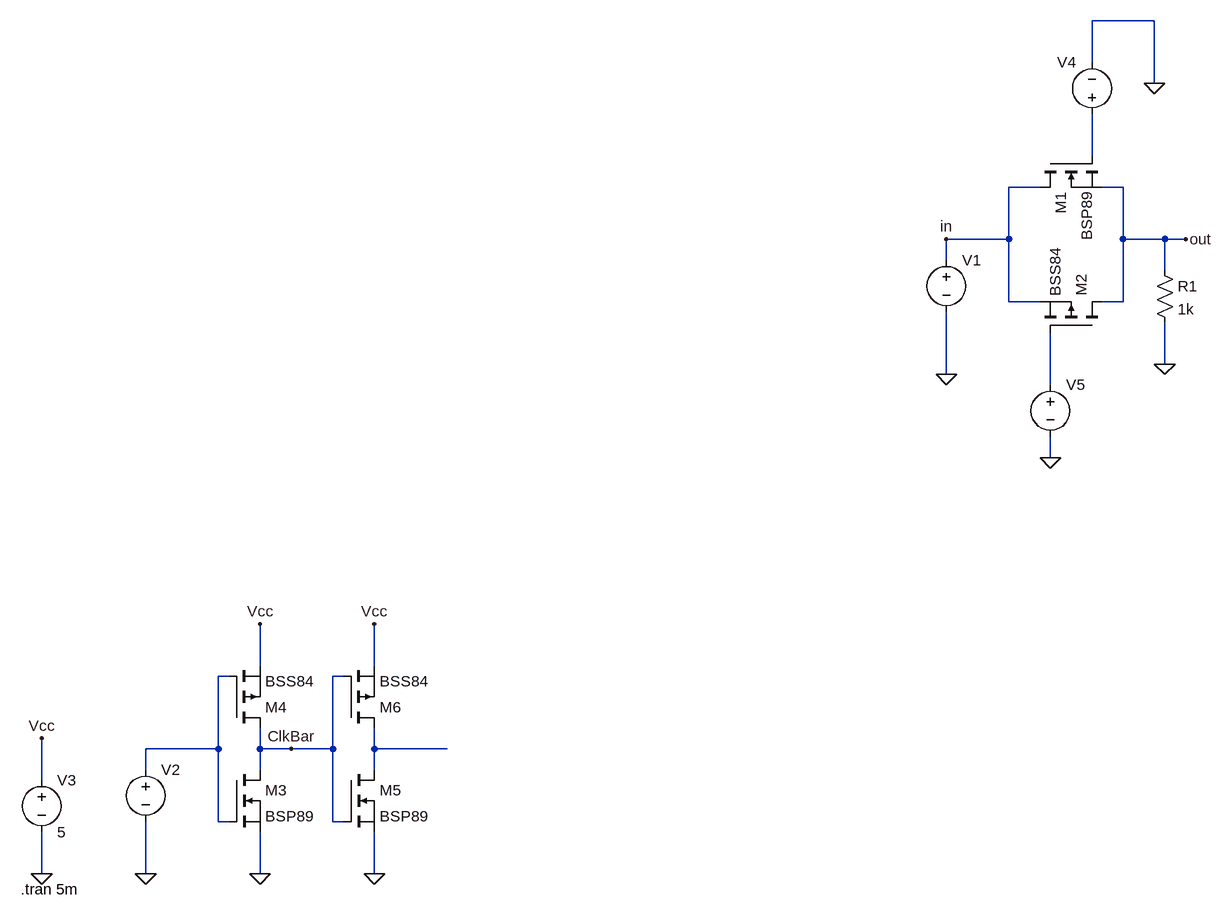
[diagram p0: schematic TransmissionGate.asc]
TransmissionGate.asc, the LTspice schematic file:
Version 4.1
SHEET 1 880 1224
WIRE 352 -128 256 -128
WIRE 256 -64 256 -128
WIRE 352 -32 352 -128
WIRE 256 80 256 16
WIRE 176 128 128 128
WIRE 304 128 272 128
WIRE 128 208 128 128
WIRE 128 208 32 208
WIRE 304 208 304 128
WIRE 368 208 304 208
WIRE 400 208 368 208
WIRE 32 240 32 208
WIRE 368 256 368 208
WIRE 128 304 128 208
WIRE 176 304 128 304
WIRE 304 304 304 208
WIRE 304 304 272 304
WIRE 368 400 368 336
WIRE 32 416 32 320
WIRE 192 432 192 352
WIRE 192 544 192 512
WIRE -1024 864 -1024 800
WIRE -848 864 -848 800
WIRE -1072 880 -1088 880
WIRE -896 880 -912 880
WIRE -1088 992 -1088 880
WIRE -1088 992 -1200 992
WIRE -1024 992 -1024 960
WIRE -976 992 -1024 992
WIRE -912 992 -912 880
WIRE -912 992 -976 992
WIRE -848 992 -848 960
WIRE -736 992 -848 992
WIRE -1200 1024 -1200 992
WIRE -1024 1024 -1024 992
WIRE -848 1024 -848 992
WIRE -1360 1040 -1360 976
WIRE -1088 1104 -1088 992
WIRE -1072 1104 -1088 1104
WIRE -912 1104 -912 992
WIRE -896 1104 -912 1104
WIRE -1360 1184 -1360 1120
WIRE -1200 1184 -1200 1104
WIRE -1024 1184 -1024 1120
WIRE -848 1184 -848 1120
FLAG 32 416 0
FLAG -1024 1184 0
FLAG -1200 1184 0
FLAG -1360 1184 0
FLAG -1360 976 Vcc
FLAG -1024 800 Vcc
FLAG -976 992 ClkBar
FLAG 32 208 in
FLAG 400 208 out
FLAG 368 400 0
FLAG -848 1184 0
FLAG -848 800 Vcc
FLAG 192 544 0
FLAG 352 -32 0
SYMBOL voltage 32 224 R0
WINDOW 3 24 96 Invisible 2
WINDOW 123 0 0 Left 0
WINDOW 39 0 0 Left 0
SYMATTR Value PULSE(0 3.3 0.2m 0.1n 0.1n 1m 2m 10)
SYMATTR InstName V1
SYMBOL nmos -1072 1024 R0
SYMATTR InstName M3
SYMATTR Value BSP89
SYMBOL pmos -1072 960 M180
SYMATTR InstName M4
SYMATTR Value BSS84
SYMBOL voltage -1200 1008 R0
WINDOW 3 24 96 Invisible 2
WINDOW 123 0 0 Left 0
WINDOW 39 0 0 Left 0
SYMATTR Value PULSE(0 5 0 0 0 4u 8u 10)
SYMATTR InstName V2
SYMBOL voltage -1360 1024 R0
WINDOW 123 0 0 Left 0
WINDOW 39 0 0 Left 0
SYMATTR InstName V3
SYMATTR Value 5
SYMBOL nmos 176 80 M90
SYMATTR InstName M1
SYMATTR Value BSP89
SYMBOL pmos 272 352 M270
SYMATTR InstName M2
SYMATTR Value BSS84
SYMBOL nmos -896 1024 R0
SYMATTR InstName M5
SYMATTR Value BSP89
SYMBOL pmos -896 960 M180
SYMATTR InstName M6
SYMATTR Value BSS84
SYMBOL voltage 256 32 R180
WINDOW 0 24 96 Left 2
WINDOW 3 24 16 Invisible 2
WINDOW 123 0 0 Left 0
WINDOW 39 0 0 Left 0
SYMATTR InstName V4
SYMATTR Value PULSE(0 5 0 0.1n 0.1n 4m 8m 10)
SYMBOL voltage 192 416 R0
WINDOW 3 24 96 Invisible 2
WINDOW 123 0 0 Left 0
WINDOW 39 0 0 Left 0
SYMATTR Value PULSE(0 5 4m 0.1n 0.1n 4m 8m 10)
SYMATTR InstName V5
SYMBOL res 352 240 R0
SYMATTR InstName R1
SYMATTR Value 1k
TEXT -1392 1208 Left 2 !.tran 5m

The netlist it stands for:
* TransmissionGate.asc
V1 in 0 PULSE(0 3.3 0.2m 0.1n 0.1n 1m 2m 10)
M3 ClkBar N003 0 0 BSP89
M4 ClkBar N003 Vcc Vcc BSS84
V2 N003 0 PULSE(0 5 0 0 0 4u 8u 10)
V3 Vcc 0 5
M1 in N001 out out BSP89
M2 out N002 in in BSS84
M5 N004 ClkBar 0 0 BSP89
M6 N004 ClkBar Vcc Vcc BSS84
V4 N001 0 PULSE(0 5 0 0.1n 0.1n 4m 8m 10)
V5 N002 0 PULSE(0 5 4m 0.1n 0.1n 4m 8m 10)
R1 out 0 1k
.model NMOS NMOS
.model PMOS PMOS
.lib standard.mos
.tran 5m
.backanno
.end

* Results of the author's LTspice run, read from the files saved beside the schematic
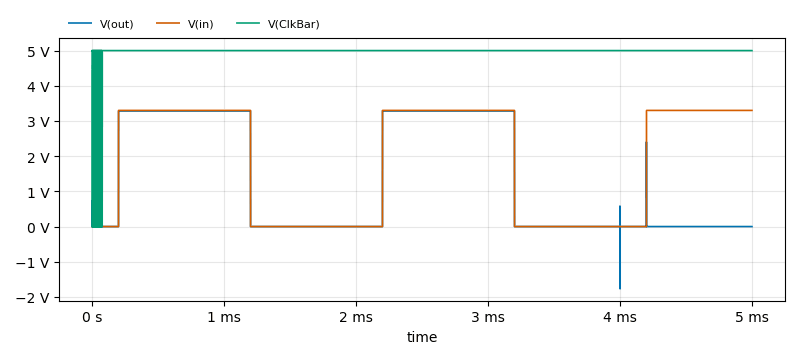
[diagram p1: Transient Analysis of TransmissionGate.asc, plotted from the saved traces]
* Transient Analysis, 1 run:
*   V(out): min -1.768 V, max 3.283 V, average 1.313 V, rms 2.076 V, last 49.98 µV
*   V(in): min 0 V, max 3.3 V, average 1.848 V, rms 2.469 V, last 3.3 V
*   V(ClkBar): min -10.88 mV, max 5.006 V, average 4.955 V, rms 4.977 V, last 5 V